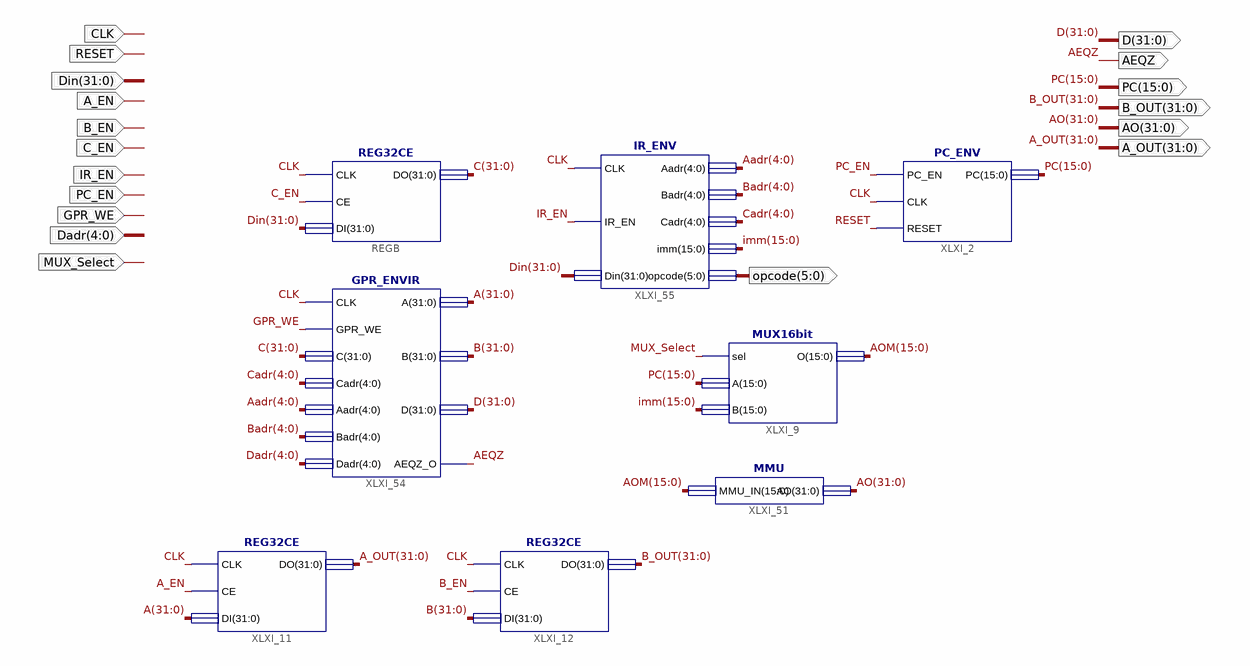
[diagram p0: schematic sheet 1]
// Xilinx ISE schematic datapath_lab5.sch (spartan6) as structural Verilog: 8 symbols, 18 ports
module datapath_lab5 (
  input  CLK,
  input  [31:0] Din,
  input  A_EN,
  input  B_EN,
  input  C_EN,
  input  IR_EN,
  input  PC_EN,
  input  GPR_WE,
  input  [4:0] Dadr,
  input  MUX_Select,
  input  RESET,
  output [31:0] D,
  output AEQZ,
  output [15:0] PC,
  output [31:0] AO,
  output [31:0] A_OUT,
  output [31:0] B_OUT,
  output [5:0] opcode
);

  wire [4:0] Aadr, Badr, Cadr;
  wire [15:0] AOM, imm;
  wire [31:0] A, B, C;

  REG32CE REGB (.CLK(CLK), .CE(C_EN), .DI(Din), .DO(C));
  PC_ENV XLXI_2 (.PC_EN(PC_EN), .CLK(CLK), .RESET(RESET), .PC(PC));
  REG32CE XLXI_12 (.CLK(CLK), .CE(B_EN), .DI(B), .DO(B_OUT));
  REG32CE XLXI_11 (.CLK(CLK), .CE(A_EN), .DI(A), .DO(A_OUT));
  GPR_ENVIR XLXI_54 (
    .CLK(CLK), .GPR_WE(GPR_WE), .C(C), .Cadr(Cadr), .Aadr(Aadr), .Badr(Badr), .Dadr(Dadr), .A(A), .B(B),
    .D(D), .AEQZ_O(AEQZ));
  IR_ENV XLXI_55 (
    .CLK(CLK), .IR_EN(IR_EN), .Din(Din), .Aadr(Aadr), .Badr(Badr), .Cadr(Cadr), .imm(imm), .opcode(opcode));
  MUX16bit XLXI_9 (.sel(MUX_Select), .A(PC), .B(imm), .O(AOM));
  MMU XLXI_51 (.MMU_IN(AOM), .AO(AO));
endmodule
